# Altium schematic sheet 02_ RF & Power.SchDoc
size 420 x 297 mm
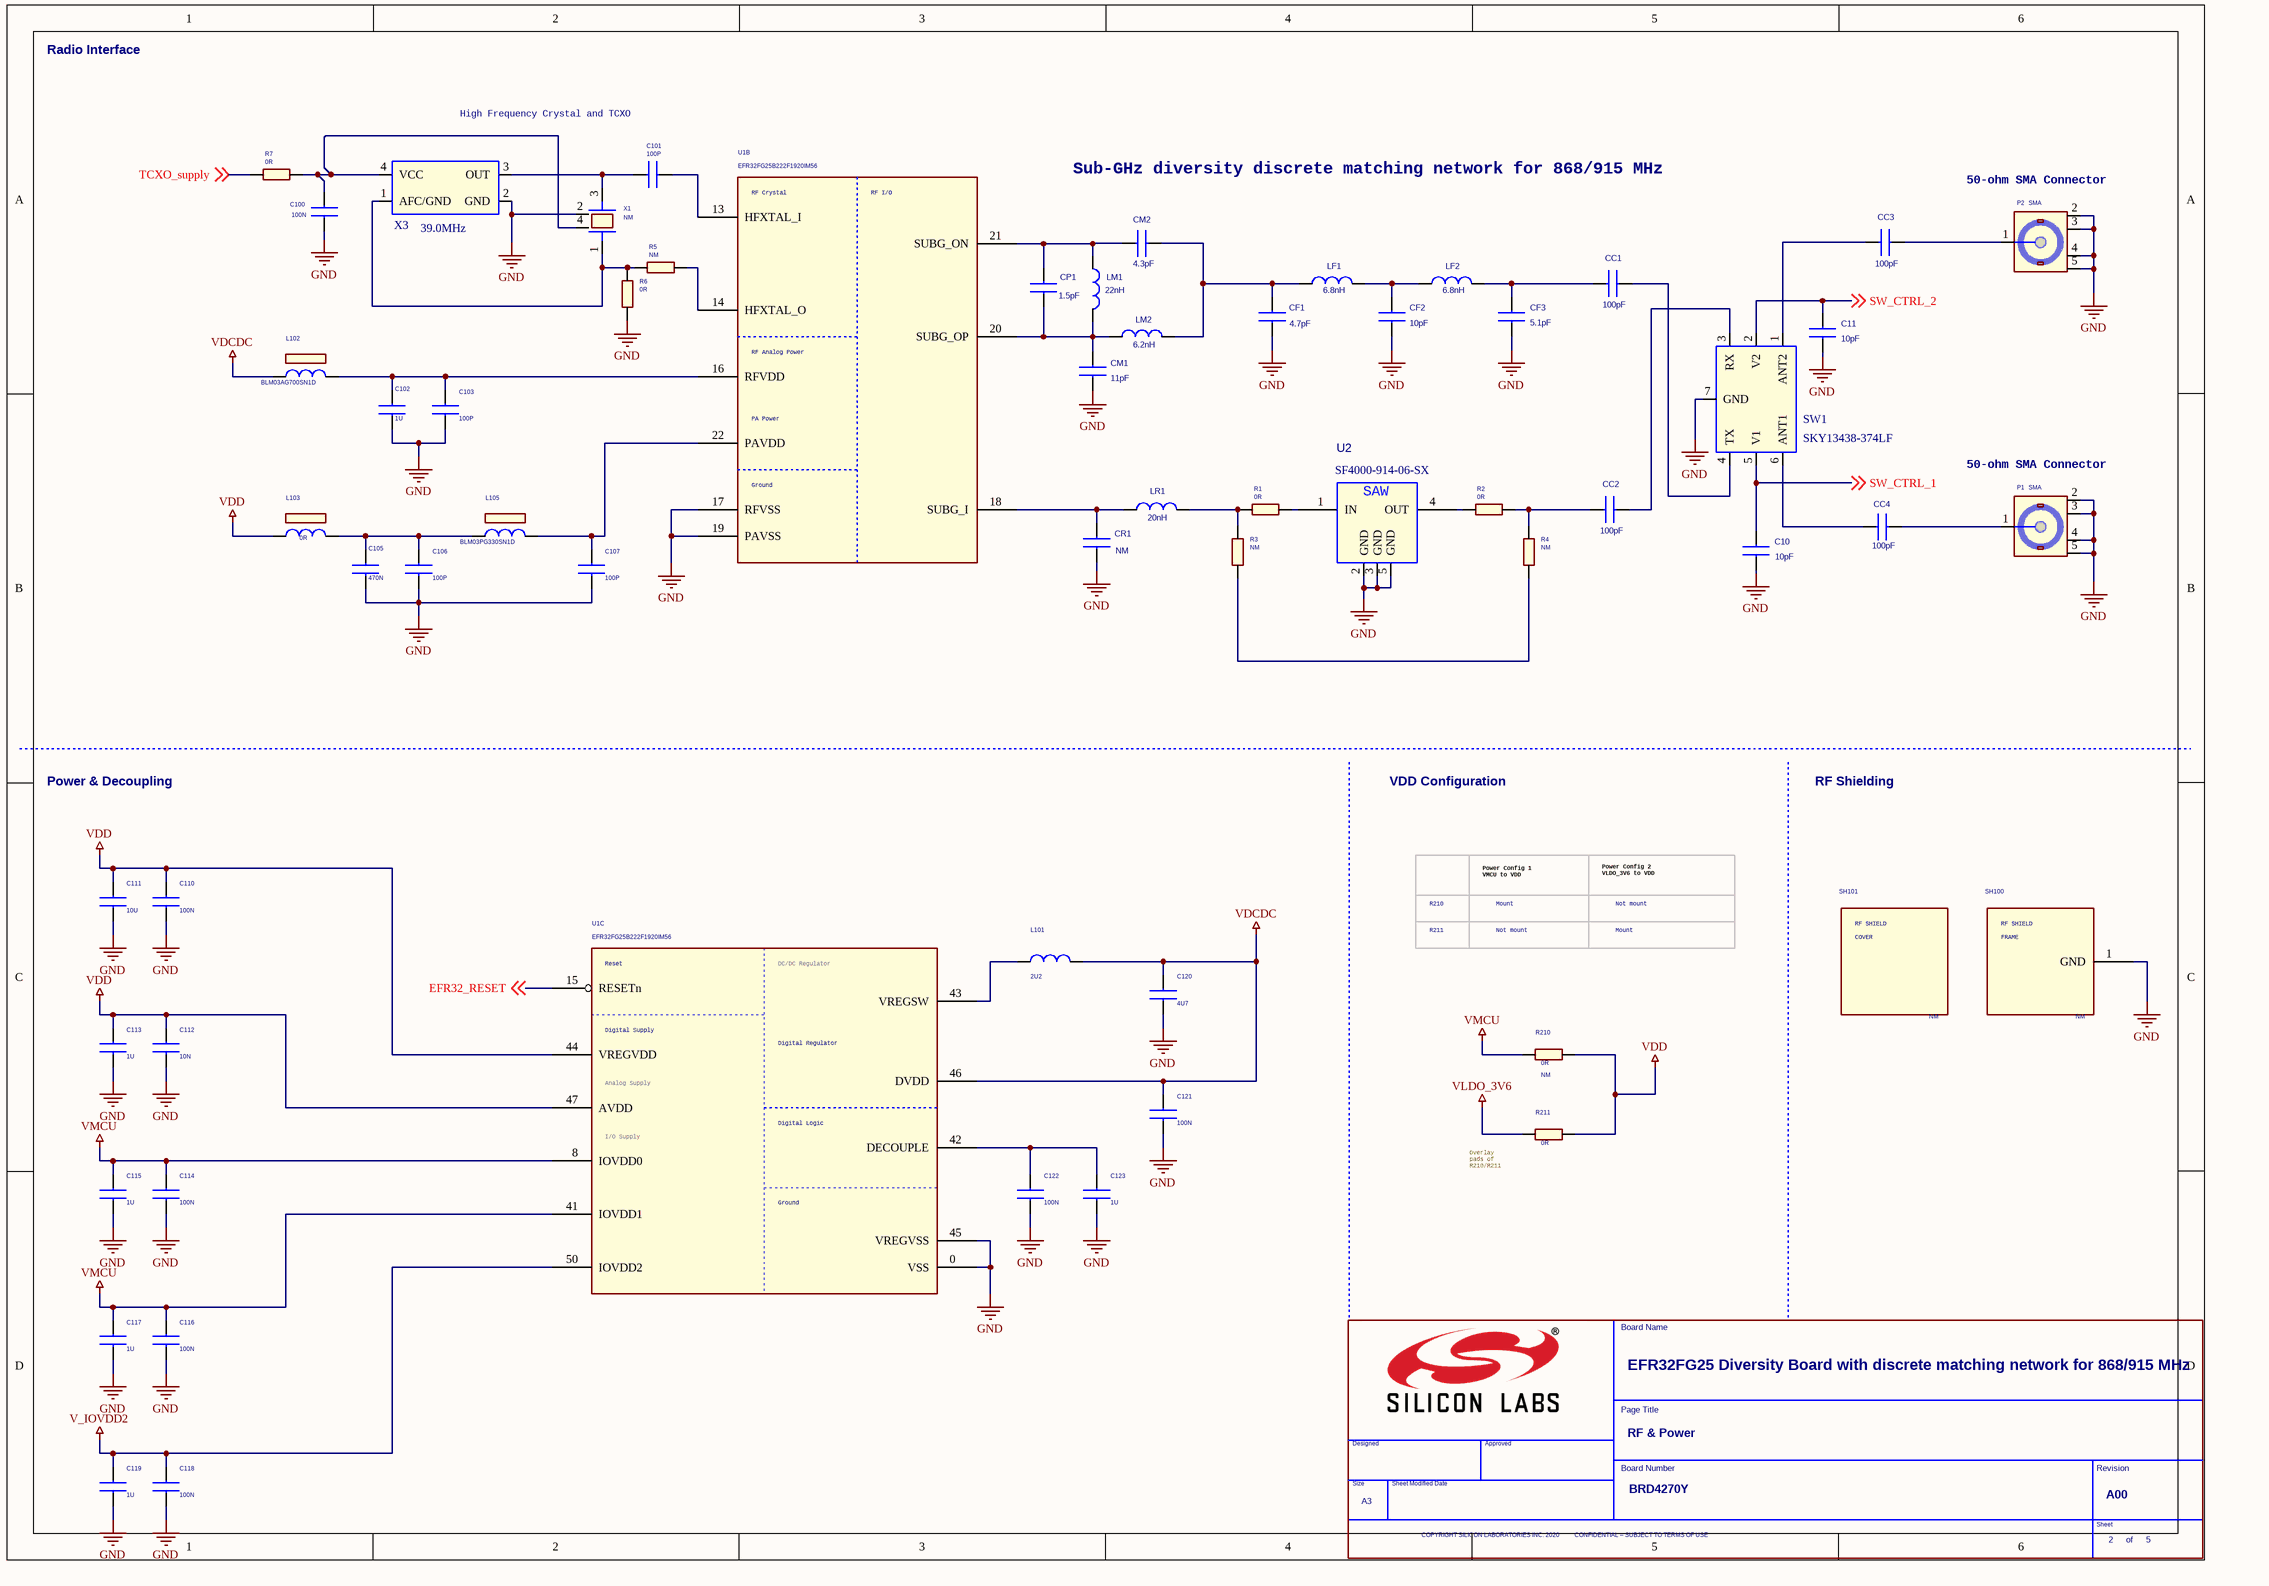
[diagram p0: 02_ RF & Power.SchDoc]

## Parts
*  Title: EFR32FG25 Diversity Board with discrete matching network for 868/915 MHz  Page Count: 5  Page Number: 2  Page Size: A3  Page Title: RF & Power  Board Number: BRD4270Y  RevCode: A00  (hidden comment: TitleBlock_SiliconLabs_A3)  (graphical)
C10  10pF  [C0201_L]
C11  10pF  [C0201_L]
C100  100N  [C0201_L]
C101  100P  [C0201_L]
C102  1U  [C0402_L]
C103  100P  [C0201_L]
C105  470N  [C0402_L]
C106  100P  [C0201_L]
C107  100P  [C0201_L]
C110  100N  [C0201_L]
C111  10U  [C0603_L]
C112  10N  [C0201_L]
C113  1U  [C0402_L]
C114  100N  [C0201_L]
C115  1U  [C0402_L]
C116  100N  [C0201_L]
C117  1U  [C0402_L]
C118  100N  [C0201_L]
C119  1U  [C0402_L]
C120  4U7  [C0603_L]
C121  100N  [C0201_L]
C122  100N  [C0201_L]
C123  1U  [C0402_L]
CC1  100pF  [C0201_L]
CC2  100pF  [C0201_L]
CC3  100pF  [C0201_L]
CC4  100pF  [C0201_L]
CF1  4.7pF  [C0201_L]
CF2  10pF  [C0201_L]
CF3  5.1pF  [C0201_L]
CM1  11pF  [C0201_L]
CM2  4.3pF  [C0201_L]
CP1  1.5pF  [C0201_L]
CR1  Not Mounted: NM  [C0201_L]  (hidden comment: Unused)
L101  2U2  [COIL_1008_L]
L102  BLM03AG700SN1D  [COIL_MUR_BLM03_0201]
L103  0R  [COIL_MUR_BLM03_0201]
L105  BLM03PG330SN1D  [COIL_MUR_BLM03_0201]
LF1  6.8nH  [COIL_0201_L]
LF2  6.8nH  [COIL_0201_L]
LM1  22nH  [COIL_0201_L]
LM2  6.2nH  [COIL_0201_L]
LR1  20nH  [COIL_0201_L]
P1  SMA  [TE_SMA_1814832_TH_VER]
P2  SMA  [TE_SMA_1814832_TH_VER]
R1  0R  [R0201_L]
R2  0R  [R0201_L]
R3  NM  [R0201_L]
R4  NM  [R0201_L]
R5  NM  [R0201_L]
R6  0R  [R0201_L]
R7  0R  [R0201_L]
R210  0R  Not Mounted: NM  [R0402_L]
R211  0R  [R0402_L]
SH100  Not Mounted: NM  [LAIRD_BMI-S-203-F]  (hidden comment: RF_SHIELD_FRAME_BMI-S-203-F)
SH101  Not Mounted: NM  (hidden comment: RF_SHIELD_COVER_BMI-S-203-C)
SW1  SKY13438-374LF  [SKY13438-374LF_footprint]
U1  EFR32FG25B222F1920IM56  [QFN56_M040_7.0X7.0_EP_SL]  (parts B,C of 3)
U2  SF4000-914-06-SX  [SF1256]
X1  NM  [X_SSS_DSX211SH_2.05X1.65-4]
X3  39.0MHz  [TCXO TX0862AAAM53_SMD2016]

## Nets
GND: C10.2 C11.2 C100.2 C102.2 C103.2 C105.2 C106.2 C107.2 C110.2 C111.2 C112.2 C113.2 C114.2 C115.2 C116.2 C117.2 C118.2 C119.2 C120.2 C121.2 C122.2 C123.2 CF1.2 CF2.2 CF3.2 CM1.2 CR1.2 P1.2(GND1) P1.3(GND2) P1.4(GND3) P1.5(GND4) P2.2(GND1) P2.3(GND2) P2.4(GND3) P2.5(GND4) R6.1 SH100.1(GND) SW1.7(GND) U1.0(VSS) U1.17(RFVSS) U1.19(PAVSS) U1.45(VREGVSS) U2.2(GND) U2.3(GND) U2.5(GND) X1.2 X3.2(GND)
V_IOVDD2: C118.1 C119.1 U1.50(IOVDD2)
VDCDC: C120.1 C121.1 L101.2 L102.1 U1.46(DVDD)
VDD: C110.1 C111.1 C112.1 C113.1 L103.1 R210.2 R211.2 U1.44(VREGVDD) U1.47(AVDD)
VLDO_3V6: R211.1
VMCU: C114.1 C115.1 C116.1 C117.1 R210.1 U1.8(IOVDD0) U1.41(IOVDD1)
EFR32_RESET: U1.15(RESETn) ; off-sheet EFR32_RESET
SW_CTRL_1: C10.1 SW1.5(V1) ; off-sheet SW_CTRL_1
SW_CTRL_2: C11.1 SW1.2(V2) ; off-sheet SW_CTRL_2
TCXO_supply: R7.1 ; off-sheet TCXO_supply
NetC100_1: C100.1 R7.2 X1.4 X3.4(VCC)
NetC101_1: C101.1 X1.3 X3.3(OUT)
NetC101_2: C101.2 U1.13(HFXTAL_I)
NetC102_1: C102.1 C103.1 L102.2 U1.16(RFVDD)
NetC105_1: C105.1 C106.1 L103.2 L105.1
NetC107_1: C107.1 L105.2 U1.22(PAVDD)
NetC122_1: C122.1 C123.1 U1.42(DECOUPLE)
NetCC1_1: CC1.1 CF3.1 LF2.2
NetCC1_2: CC1.2 SW1.4(TX)
NetCC2_1: CC2.1 R2.2 R4.2
NetCC2_2: CC2.2 SW1.3(RX)
NetCC3_1: CC3.1 SW1.1(ANT2)
NetCC3_2: CC3.2 P2.1(SIGNAL)
NetCC4_1: CC4.1 SW1.6(ANT1)
NetCC4_2: CC4.2 P1.1(SIGNAL)
NetCF1_1: CF1.1 CM2.2 LF1.1 LM2.2
NetCF2_1: CF2.1 LF1.2 LF2.1
NetCM1_1: CM1.1 CP1.2 LM1.2 LM2.1 U1.20(SUBG_OP)
NetCM2_1: CM2.1 CP1.1 LM1.1 U1.21(SUBG_ON)
NetCR1_1: CR1.1 LR1.1 U1.18(SUBG_I)
NetL101_1: L101.1 U1.43(VREGSW)
NetLR1_2: LR1.2 R1.1 R3.2
NetR1_2: R1.2 U2.1(IN)
NetR2_1: R2.1 U2.4(OUT)
NetR3_1: R3.1 R4.1
NetR5_1: R5.1 R6.2 X1.1 X3.1(AFC/GND)
NetR5_2: R5.2 U1.14(HFXTAL_O)

## Notes on the sheet
- Radio Interface
- High Frequency Crystal and TCXO
- Sub-GHz diversity discrete matching network for 868/915 MHz
- (near P2) 50-ohm SMA Connector
- (near P1) 50-ohm SMA Connector
- Power & Decoupling
- VDD Configuration
- RF Shielding
- R210
- Power Config 1
  VMCU to VDD
- Mount
- Power Config 2
  VLDO_3V6 to VDD
- Not mount
- R211
- (near R211) Overlay
  pads of
  R210/R211
- (in symbol EFR32xG25_QFN56_HFCLKOUT, part B) RF Crystal; RF I/O; RF Analog Power; PA Power; Ground
- (in symbol EFR32xG25_QFN56_HFCLKOUT, part C) Reset; DC/DC Regulator; Digital Supply; Digital Regulator; Analog Supply; Digital Logic; I/O Supply; Ground
- (in symbol RF_SHIELD_COVER_BMI-S-203-C) RF SHIELD; COVER
- (in symbol RF_SHIELD_FRAME_BMI-S-203-F) RF SHIELD; FRAME
- (in symbol SF4000-914-06-SX) SAW
- (in symbol TitleBlock_SiliconLabs_A3) Board Name; Page Title; Designed; Approved; Board Number; Revision; Size; Sheet Modified Date; Sheet; COPYRIGHT SILICON LABORATORIES INC. 2020          CONFIDENTIAL – SUBJECT TO TERMS OF USE; of

## Library data of the parts
* = TitleBlock_SiliconLabs_A3: Board Approver: RGU; OrgName: Silicon Labs
C10 C11 CF3 = C0201: Tolerance: ±0.05P; Mfg: Murata; Mfg #: GRM0335C1H2R8WA01D; Technology: C0G
C100 C110 C114 C116 C118 C121 C122 = C0201: Rating: 16V; Tolerance: 20%; Technology: X7S
C101 C103 C106 C107 = C0201: Rating: 25V; Tolerance: 5%; Technology: C0G
C102 C113 C115 C117 C119 C123 = C0402: Rating: 6.3V; Tolerance: 10%; Technology: X7R
C105 = C0402: Rating: 10V; Tolerance: 10%; Technology: X7R
C111 = C0603: Rating: 6.3V; Tolerance: 20%; Technology: X7R
C112 = C0201: Rating: 16V; Tolerance: 10%; Technology: X7R
C120 = C0603: Rating: 6.3V; Tolerance: 10%; Technology: X7R
CC1-CC4 CM2 CR1 = C0201: Tolerance: ±0.05P; Mfg: Murata; Technology: C0G
CF1 CP1 = C0201: Tolerance: ±0.1P; Mfg: Murata; Mfg #: GRM0335C1H3R8BA01D; Technology: C0G
CF2 = C0201: Tolerance: ±0.1P; Mfg: Murata; Mfg #: GRM0335C1H4R0BA01D; Technology: C0G
CM1 = C0201: Tolerance: ±0.1P; Mfg: Murata; Mfg #: GRM0335C1H9R4BA01D; Technology: C0G
L101 = L1008: Mfg: Murata; Mfg #: DFE2HCAH2R2MJ0L; Tolerance: +/-20%
L102 L105 = BLM03AX: Mfg: Murata; Price_1K: 0.05
  L102: Mfg #: BLM03AG700SN1D
  L105: Mfg #: BLM03PG330SN1D
L103 = BLM03AX: Price_1K: 0.05
LF1 = L0201: Tolerance: ±3%; Mfg #: LQP03HQ6N2H02D; Mfg: Murata
LF2 = L0201: Tolerance: ±3%; Mfg #: LQP03HQ8N2H02D; Mfg: Murata
LM1 = L0201: Tolerance: ±0.1N; Mfg #: LQP03HQ1N6B02D; Mfg: Murata
LM2 = L0201
LR1 = L0201: Tolerance: ±3%; Mfg #: LQP03HQ16NH02D; Mfg: Murata
P1 P2 = SMA_TH_WELLSHOW: Mfg #: C02AN31P00101; Mfg: Wellshow; Price_1K: 1.46
R1-R7 = R0201: Price_1K: 0.005
R210 R211 = R0402: Price_1K: 0.005
SH100 = RF_SHIELD_FRAME_BMI-S-203-F: Mfg: Laird Technologies; Footprint: Laird_BMI-S-203-F; Mfg #: BMI-S-203-F; Price_1k: 1.148
SH101 = RF_SHIELD_COVER_BMI-S-203-C: Mfg: Laird Technologies; Price_1k: 0.814; Mfg #: BMI-S-203-C
SW1 = Switch DPDT: Part Reference: SW1; Mfg #: BGS12WN6E6327XTSA1; Mfg: Infineon; PCB Footprint: XFDFN-6
U1 = EFR32xG25_QFN56_HFCLKOUT: MFG #: EFR32FG25B222F1920IM56-AR; MFG: Silicon Labs
U2 = SF4000-914-06-SX: B2645 from Qualcomm also fits; Part Reference: U5; Mfg: ACTE; Value: SF4000-914-06-SX (US); Mfg #: SF4000-914-06-SX; PCB Footprint: SF1256
X1 = DSX211SH: Mfg: Tai-Saw; Mfg #: TZ3541C; Price_1K: 0.512
X3 = TCXO TX0862AAAM53: Part Reference: X1; Mfg #: 7Z-38.400MBG-T; Mfg: TXC; Value: 38.4MHz; PCB Footprint: TCXO_7Z-38.400MBG-T_SMD2016_TXC